# Altium project PIFWRobot.PrjPcb
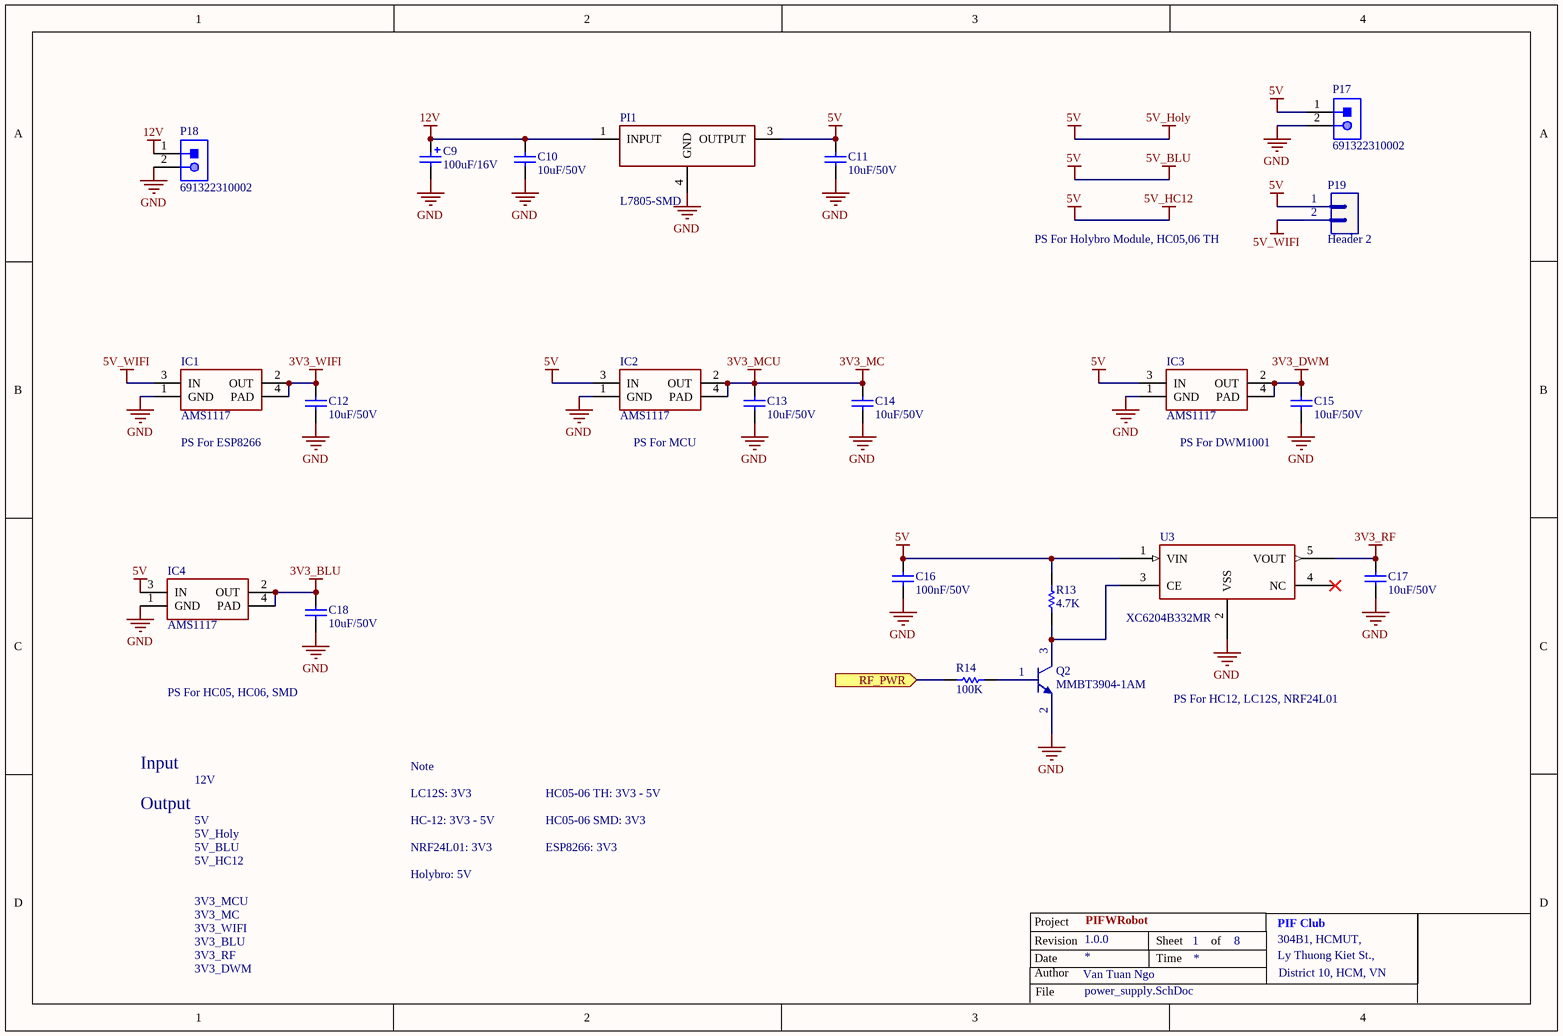
[diagram p0: power_supply.SchDoc]
5 sheets, 99 parts. Net scope: flat (ports and power ports of the same name join across sheets).
Board file: PIFWRobot.PcbDoc
Sheets:
  power_supply.SchDoc
  motor_controller.SchDoc
  bluetooth.SchDoc
  radio_frequency.SchDoc
  decawave.SchDoc

## Sheet power_supply.SchDoc
size A4; DrawnBy: Van Tuan Ngo; Organization: PIF Club; Address1: 304B1, HCMUT,; Address2: Ly Thuong Kiet St.,; Address3: District 10, HCM, VN; DocumentNumber: 1; Revision: 1.0.0; SheetNumber: 1; SheetTotal: 8; Project: PIFWRobot

### Parts
C9  value 100uF/16V  [CAP-SM-AL-SIZE-D-D6L6]  (hidden comment: Cap-Al-100uF-16V-D6L5)
C10  value 10uF/50V  [CAP-SM-0805]  (hidden comment: Cap-10uF-50V-0805)
C11  value 10uF/50V  [CAP-SM-0805]  (hidden comment: Cap-10uF-50V-0805)
C12  value 10uF/50V  [CAP-SM-0805]  (hidden comment: Cap-10uF-50V-0805)
C13  value 10uF/50V  [CAP-SM-0805]  (hidden comment: Cap-10uF-50V-0805)
C14  value 10uF/50V  [CAP-SM-0805]  (hidden comment: Cap-10uF-50V-0805)
C15  value 10uF/50V  [CAP-SM-0805]  (hidden comment: Cap-10uF-50V-0805)
C16  value 100nF/50V  [CAP-SM-0805]  (hidden comment: Cap-100nF-50V-0805)
C17  value 10uF/50V  [CAP-SM-0805]  (hidden comment: Cap-10uF-50V-0805)
C18  value 10uF/50V  [CAP-SM-0805]  (hidden comment: Cap-10uF-50V-0805)
IC1  AMS1117  [SOT223]
IC2  AMS1117  [SOT223]
IC3  AMS1117  [SOT223]
IC4  AMS1117  [SOT223]
P17  691322310002  [691322310002]
P18  691322310002  [691322310002]
P19  Header 2  [JP2]
PI1  L7805-SMD  [TO254P1435X464-4N]
Q2  MMBT3904-1AM  [SOT23_NEX]
R13  value 4.7K  [RES-SM-0805]  (hidden comment: Res-4.7K-0805)
R14  value 100K  [RES-SM-0805]  (hidden comment: Res-100K-0805)
U3  XC6204B332MR  [XC6204/05_SOT-00]

### Ports
RF_PWR (in)

### Nets
3V3_BLU: C18.2 IC4.2(OUT) IC4.4(PAD)
3V3_DWM: C15.2 IC3.2(OUT) IC3.4(PAD)
3V3_MC: C13.2 C14.2 IC2.2(OUT) IC2.4(PAD)  [also labelled 3V3_MCU]
3V3_RF: C17.2 U3.5(VOUT)
3V3_WIFI: C12.2 IC1.2(OUT) IC1.4(PAD)
5V: C11.2 C16.2 IC2.3(IN) IC3.3(IN) IC4.3(IN) P17.1 P19.1 PI1.3(OUTPUT) R13.2 U3.1(VIN)  [also labelled 5V_BLU, 5V_HC12, 5V_Holy]
5V_WIFI: IC1.3(IN) P19.2
12V: C9.1 C10.2 P18.1 PI1.1(INPUT)
GND: C9.2 C10.1 C11.1 C12.1 C13.1 C14.1 C15.1 C16.1 C17.1 C18.1 IC1.1(GND) IC2.1(GND) IC3.1(GND) IC4.1(GND) P17.2 P18.2 PI1.4(GND) Q2.2(E) U3.2(VSS)
NetQ2_1: Q2.1(B) R14.2
NetQ2_3: Q2.3(C) R13.1 U3.3(CE)
NetR14_1: R14.1 ; port RF_PWR

Not connected (* = marked no-connect by the designer): U3 4(NC)*

### Notes on the sheet
- PS For Holybro Module, HC05,06 TH
- PS For ESP8266
- (near IC2) PS For MCU
- PS For DWM1001
- PS For HC05, HC06, SMD
- PS For HC12, LC12S, NRF24L01
- Input
- 12V
- Note
- Output
- 5V
- 5V_Holy
- 5V_BLU
- LC12S: 3V3
- HC-12: 3V3 - 5V
- NRF24L01: 3V3
- HC05-06 TH: 3V3 - 5V
- HC05-06 SMD: 3V3
- ESP8266: 3V3
- 3V3_MCU
- 5V_HC12
- 3V3_MC
- Holybro: 5V
- 3V3_WIFI
- 3V3_BLU
- 3V3_RF
- 3V3_DWM
- Project
- Revision
- Date
- Author
- Sheet
- Time
- of
- File

### Library data of the parts
C9 = Cap-Al-100uF-16V-D6L5: CAP ALUM 100UF 20% 16V SMD; Manufacturer: Nichicon; Manufacturer Part Number: UWX1C101MCL1GB; Local Supplier: thegioiic; Local Supplier Link: https://www.thegioiic.com/products/tu-nhom-smd-100uf-16v-6-3x5-4mm; Supplier 1: Digikey; Supplier 1 Part Number: 493-2105-1-ND; Supplier 1 Link: https://www.digikey.com/product-detail/en/nichicon/UWX1C101MCL1GB/493-2105-1-ND/590080
C10-C15 C17 C18 = Cap-10uF-50V-0805: CAP CER 10UF 50V X5R 0805; Manufacturer: Yageo; Manufacturer Part Number: CC0805KKX5R9BB106; Local Supplier: thegioiic; Local Supplier Link: https://www.thegioiic.com/products/tu-gom-0805-10uf-50v; Supplier 1: Digikey; Supplier 1 Link: https://www.digikey.com/product-detail/en/yageo/CC0805KKX5R9BB106/311-3499-2-ND/7164383; Supplier 1 Part Number: 311-3499-2-ND
C16 = Cap-100nF-50V-0805: CAP CER 0.1UF 50V Y5V 0805; Manufacturer: Samsung Electro-Mechanics; Manufacturer Part Number: CL21F104ZBCNNNC; Local Supplier: thegioiic; Local Supplier Link: https://thegioiic.com/products/tu-100nf-0-1uf-50v-0805; Supplier 1: Digikey; Supplier 1 Part Number: 1276-1007-1-ND; Supplier 1 Link: https://www.digikey.com/product-detail/en/samsung-electro-mechanics/CL21F104ZBCNNNC/1276-1007-1-ND/3889093
IC1-IC4 = AMS1117: Available in 1.8V, 2.5V, 2.85V, 3.3V, 5V, and  Adjustable Versions; Local Supplier: thegioiic; Local Supplier Part Number: *; Local Supplier Link: https://www.thegioiic.com/products/ams1117-3-3v
P17 P18 = 691322310002: WR-TBL Serie 322 Horizontal PCB Header, Pluggable, pitch 3.81mm, 2p; Local Suppleir Part Number: x; Compliance: RoHS; Modularity: No; Pin Number: 2; Rated Current [UL]: 10A; Working Voltage [UL]: 300VAC; ComponentLink1Description: Manufacturer; ComponentLink1URL: http://www.we-online.de; ComponentLink2URL: https://katalog.we-online.de/em/datasheet/691322310002.pdf; ComponentLink2Description: Datasheet; Mounting Technology: THT; Part Number: 691322310002; Packaging: Box; Operating Temperature: -40 to +105degC; PCB/Cable/Panel: PCB; Pitch: 3.81mm; Published Date: October 2019; Type: Horizontal; Publisher: Wurth Elektronik; Application: Pluggable; Local Supplier: thegioiic; Local Supplier Link: https://www.thegioiic.com/products/kf-3-81-2-r-terminal-block-plug-in-han-pcb-2-chan-cong-3-81mm
P19 = Header 2: Header, 2-Pin; LatestRevisionDate: 17-Jul-2002; LatestRevisionNote: Re-released for DXP Platform.; Publisher: Altium Limited
R13 = Res-4.7K-0805: RES SMD 4.7K OHM 5% 1/8W 0805; Manufacturer: Yageo; Manufacturer Part Number: RC0805JR-074K7L; Local Supplier: thegioiic; Local Supplier Link: https://thegioiic.com/products/dien-tro-4-7k-ohm-0805-5; Supplier 1: Digikey; Supplier 1 Link: https://www.digikey.com/product-detail/en/yageo/RC0805JR-074K7L/311-4.7KARCT-ND/731274; Supplier 1 Part Number: 311-4.7KARCT-ND
R14 = Res-100K-0805: RES 0 OHM JUMPER 0805; Manufacturer: Vishay Dale; Manufacturer Part Number: WSL080500000ZEA9; Local Supplier: thegioiic; Local Supplier Link: https://thegioiic.com/products/dien-tro-0-ohm-0805-5; Supplier 1: Digikey; Supplier 1 Link: https://www.digikey.com/product-detail/en/vishay-dale/WSL080500000ZEA9/541-3928-1-ND/7423223; Supplier 1 Part Number: 541-3928-1-ND
U3 = XC6204B332MR: Vendor: Torex Semiconductor; Built_By: EMA_UL_Team; SourceLibrary: Torex_2016-07-05_1; Manufacturer_Part_Number: XC6204B332MR; Copyright: Copyright (C) 2018 Accelerated Designs. All rights reserved; RefDes: RefDes; Type: DEV; Local Supplier: thegioiic; Local Supplier Part Number: *; Local Supplier Link: https://www.thegioiic.com/products/xc6204b332mr-g-ic-on-ap-3-3v-150ma
PI1 = L7805-SMD: Local Supplier: thegioiic; Local Supplier Part Number: *; Local Supplier Link: https://www.thegioiic.com/products/l7805acd2t
Q2 = MMBT3904-1AM: Local Supplier: thegioiic; Local Supplier Link: https://www.thegioiic.com/products/mmbt3904-1am; Local Supplier Part Number: *

## Sheet motor_controller.SchDoc
size A4; DrawnBy: Van Tuan Ngo; Organization: PIF Club; Address1: 304B1, HCMUT,; Address2: Ly Thuong Kiet St.,; Address3: District 10, HCM, VN; DocumentNumber: 2; Revision: 1.0.0; SheetNumber: 2; SheetTotal: 8; Project: PIFWRobot
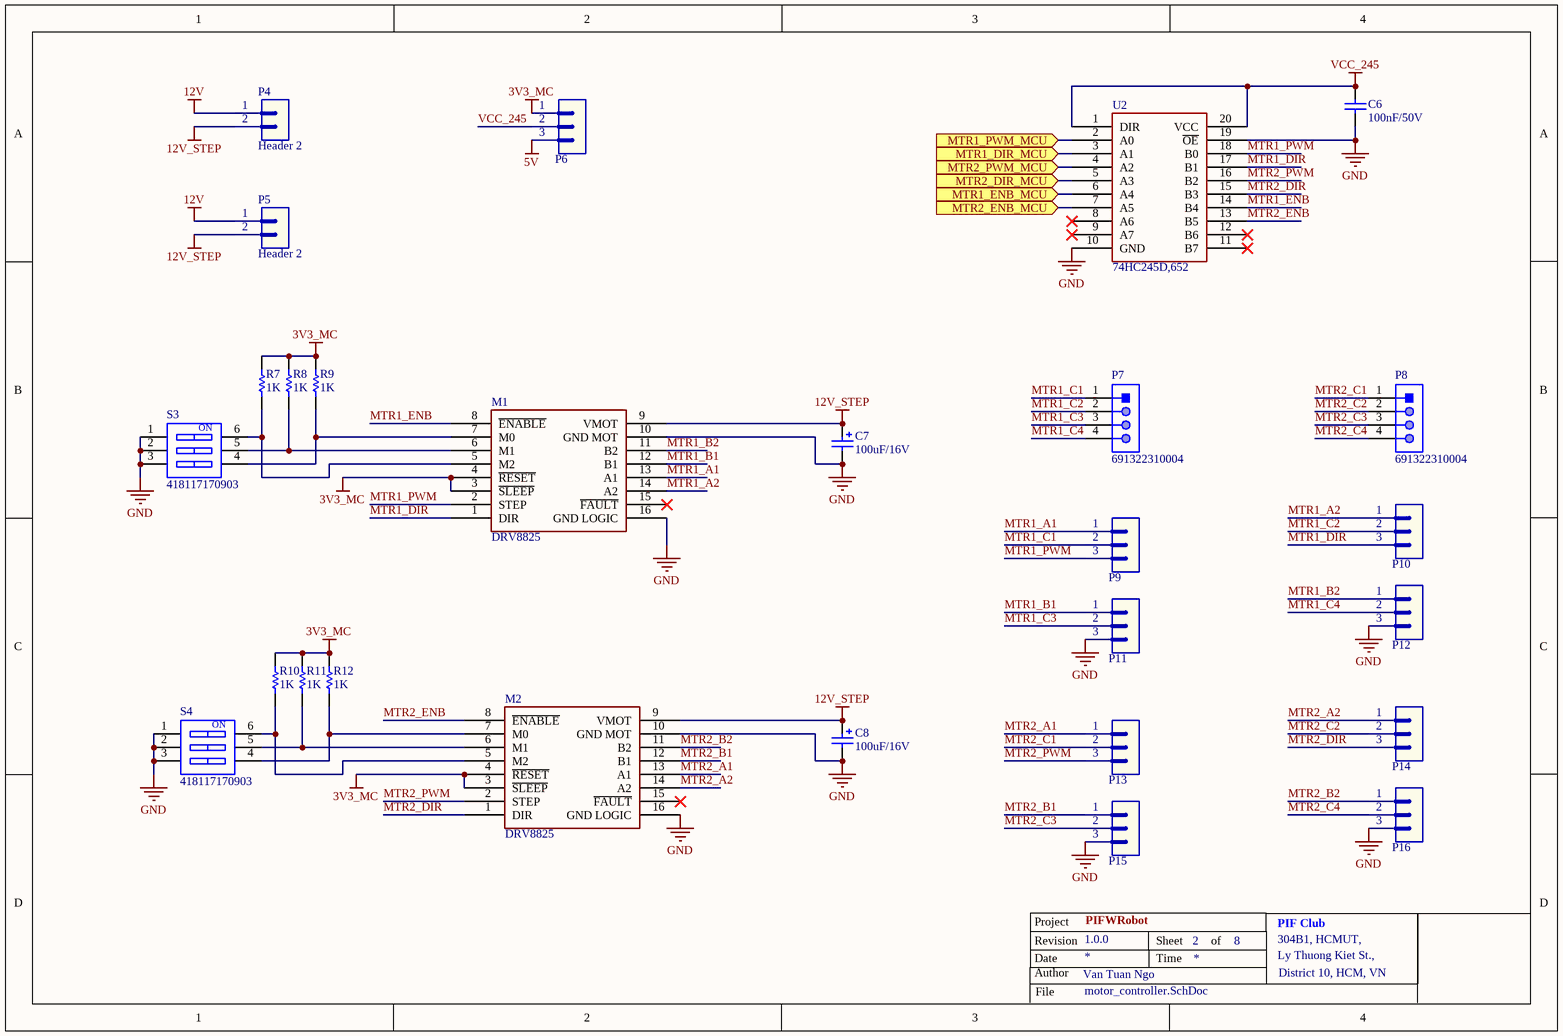
[diagram p1: motor_controller.SchDoc]

### Parts
C6  value 100nF/50V  [CAP-SM-0805]  (hidden comment: Cap-100nF-50V-0805)
C7  value 100uF/16V  [CAP-SM-AL-SIZE-D-D6L6]  (hidden comment: Cap-Al-100uF-16V-D6L5)
C8  value 100uF/16V  [CAP-SM-AL-SIZE-D-D6L6]  (hidden comment: Cap-Al-100uF-16V-D6L5)
M1  DRV8825  [DRV8825]
M2  DRV8825  [DRV8825]
P4  Header 2  [JP2]
P5  Header 2  [JP2]
P6  Header 3  [JP3]  (value not drawn)
P7  691322310004  [691322310004]
P8  691322310004  [691322310004]
P9  Header 3  [JP3]  (value not drawn)
P10  Header 3  [JP3]  (value not drawn)
P11  Header 3  [JP3]  (value not drawn)
P12  Header 3  [JP3]  (value not drawn)
P13  Header 3  [JP3]  (value not drawn)
P14  Header 3  [JP3]  (value not drawn)
P15  Header 3  [JP3]  (value not drawn)
P16  Header 3  [JP3]  (value not drawn)
R7  value 1K  [RES-SM-0805]  (hidden comment: Res-1K-0805)
R8  value 1K  [RES-SM-0805]  (hidden comment: Res-1K-0805)
R9  value 1K  [RES-SM-0805]  (hidden comment: Res-1K-0805)
R10  value 1K  [RES-SM-0805]  (hidden comment: Res-1K-0805)
R11  value 1K  [RES-SM-0805]  (hidden comment: Res-1K-0805)
R12  value 1K  [RES-SM-0805]  (hidden comment: Res-1K-0805)
S3  418117170903  [418117170903]
S4  418117170903  [418117170903]
U2  74HC245D,652  [SOT163-1_NEX]

### Ports
MTR1_DIR_MCU (in), MTR1_ENB_MCU (in), MTR1_PWM_MCU (in), MTR2_DIR_MCU (in), MTR2_ENB_MCU (in), MTR2_PWM_MCU (in)

### Nets
3V3_MC: M1.3(~{SLEEP}) M1.4(~{RESET}) M2.3(~{SLEEP}) M2.4(~{RESET}) P6.1 R7.2 R8.2 R9.2 R10.2 R11.2 R12.2
5V: P6.3
12V: P4.1 P5.1
12V_STEP: C7.1 C8.1 M1.9(VMOT) M2.9(VMOT) P4.2 P5.2
GND: C6.1 C7.2 C8.2 M1.10(GND_MOT) M1.16(GND_LOGIC) M2.10(GND_MOT) M2.16(GND_LOGIC) P11.3 P12.3 P15.3 P16.3 S3.1 S3.2 S3.3 S4.1 S4.2 S4.3 U2.10(GND) U2.19(~{OE})
VCC_245: C6.2 P6.2 U2.1(DIR) U2.20(VCC)
MTR1_A1: M1.13(A1) P9.1
MTR1_A2: M1.14(A2) P10.1
MTR1_B1: M1.12(B1) P11.1
MTR1_B2: M1.11(B2) P12.1
MTR1_C1: P7.1 P9.2
MTR1_C2: P7.2 P10.2
MTR1_C3: P7.3 P11.2
MTR1_C4: P7.4 P12.2
MTR1_DIR: M1.1(DIR) P10.3 U2.17(B1)
MTR1_ENB: M1.8(~{ENABLE}) U2.14(B4)
MTR1_PWM: M1.2(STEP) P9.3 U2.18(B0)
MTR2_A1: M2.13(A1) P13.1
MTR2_A2: M2.14(A2) P14.1
MTR2_B1: M2.12(B1) P15.1
MTR2_B2: M2.11(B2) P16.1
MTR2_C1: P8.1 P13.2
MTR2_C2: P8.2 P14.2
MTR2_C3: P8.3 P15.2
MTR2_C4: P8.4 P16.2
MTR2_DIR: M2.1(DIR) P14.3 U2.15(B3)
MTR2_ENB: M2.8(~{ENABLE}) U2.13(B5)
MTR2_PWM: M2.2(STEP) P13.3 U2.16(B2)
NetM1_5: M1.5(M2) R7.1 S3.6
NetM1_6: M1.6(M1) R8.1 S3.5
NetM1_7: M1.7(M0) R9.1 S3.4
NetM2_5: M2.5(M2) R10.1 S4.6
NetM2_6: M2.6(M1) R11.1 S4.5
NetM2_7: M2.7(M0) R12.1 S4.4
NetU2_2: U2.2(A0) ; port MTR1_PWM_MCU
NetU2_3: U2.3(A1) ; port MTR1_DIR_MCU
NetU2_4: U2.4(A2) ; port MTR2_PWM_MCU
NetU2_5: U2.5(A3) ; port MTR2_DIR_MCU
NetU2_6: U2.6(A4) ; port MTR1_ENB_MCU
NetU2_7: U2.7(A5) ; port MTR2_ENB_MCU

Not connected (* = marked no-connect by the designer): M1 15(~{FAULT})*; M2 15(~{FAULT})*; U2 8(A6)* 9(A7)* 11(B7)* 12(B6)*

### Notes on the sheet
- Project
- Revision
- Date
- Author
- Sheet
- Time
- of
- File
- (in symbol 418117170903) ON

### Library data of the parts
C6 = Cap-100nF-50V-0805: as C16 on sheet power_supply; Local Supplier: thegioiic; Local Supplier Link: https://thegioiic.com/products/tu-100nf-0-1uf-50v-0805; Supplier 1: Digikey; Supplier 1 Part Number: 1276-1007-1-ND; Supplier 1 Link: https://www.digikey.com/product-detail/en/samsung-electro-mechanics/CL21F104ZBCNNNC/1276-1007-1-ND/3889093
C7 C8 = Cap-Al-100uF-16V-D6L5: as C9 on sheet power_supply; Local Supplier: thegioiic; Local Supplier Link: https://www.thegioiic.com/products/tu-nhom-smd-100uf-16v-6-3x5-4mm; Supplier 1: Digikey; Supplier 1 Part Number: 493-2105-1-ND; Supplier 1 Link: https://www.digikey.com/product-detail/en/nichicon/UWX1C101MCL1GB/493-2105-1-ND/590080
P4 P5 = Header 2: Header, 2-Pin; LatestRevisionDate: 17-Jul-2002; LatestRevisionNote: Re-released for DXP Platform.; Publisher: Altium Limited; Local Supplier: thegioiic; Local Supplier Part Number: x; Local Supplier Link: https://www.thegioiic.com/products/hang-rao-duc-don-2-54mm-40-chan-1-hang-cao-11-4mm-xuyen-lo
P6 P9-P16 = Header 3: Header, 3-Pin; LatestRevisionDate: 17-Jul-2002; LatestRevisionNote: Re-released for DXP Platform.; Publisher: Altium Limited; Local Supplier: thegioiic; Local Supplier Part Number: x; Local Supplier Link: https://www.thegioiic.com/products/hang-rao-duc-don-2-54mm-40-chan-1-hang-cao-11-4mm-xuyen-lo
P7 P8 = 691322310004: WR-TBL Serie 322 Horizontal PCB Header, Pluggable, pitch 3.81mm, 4p; Local Suplier Part Number: x; Compliance: RoHS; Modularity: No; Pin Number: 4; Rated Current [UL]: 10A; Working Voltage [UL]: 300VAC; ComponentLink1Description: Manufacturer; ComponentLink1URL: http://www.we-online.de; ComponentLink2URL: https://katalog.we-online.de/em/datasheet/691322310004.pdf; ComponentLink2Description: Datasheet; Mounting Technology: THT; Part Number: 691322310004; Packaging: Box; Operating Temperature: -40 to +105degC; PCB/Cable/Panel: PCB; Pitch: 3.81mm; Published Date: October 2019; Type: Horizontal; Publisher: Wurth Elektronik; Application: Pluggable; Local Supplier: thegioiic; Local Supplier Link: https://www.thegioiic.com/products/ul-3-81-4-r-terminal-block-plug-in-han-pcb-4-chan-cong-3-81mm-ulo
R7-R12 = Res-1K-0805: RES 1K OHM 1% 1/4W 0805; Manufacturer: Stackpole Electronics Inc; Manufacturer Part Number: RNCP0805FTD1K00; Local Supplier: thegioiic; Local Supplier Link: https://www.thegioiic.com/products/dien-tro-1-kohm-0805-5; Supplier 1: Digikey; Supplier 1 Link: https://www.digikey.com/product-detail/en/stackpole-electronics-inc/RNCP0805FTD1K00/RNCP0805FTD1K00CT-ND/2240568; Supplier 1 Part Number: RNCP0805FTD1K00CT-ND
S3 S4 = 418117170903: WS-DITV Compact THT Dip Switch, Flat Actuator, pitch 2.54mm, 3p; Operation Force: 800g; Pole Number: 3; Actuator Type: Flat Type; Circuit: SPST-NO; Rated Current Switching: 25mA; Rated Current Non-Switching: 100mA; Rated Voltage Non-Switching: 50VDC; Rated Voltage Switching: 24VDC; ComponentLink1Description: Manufacturer; ComponentLink1URL: http://www.we-online.de; ComponentLink2Description: Datasheet; ComponentLink2URL: https://katalog.we-online.com/em/datasheet/418117170903.pdf; Pitch: 2.54mm; Contact Material: Copper Alloy; Mounting Technology: THT; Operating Temperature: -40 to +85degC; Contact Plating: Gold; Packaging: Tube; Part Number: 418117170903; Publisher: Wurth Elektronik; Published Date: September 2019; Local Supplier: thegioiic; Local Supplier Part Number: x; Local Supplier Link: https://www.thegioiic.com/products/cong-tac-3-bit-dip-switch-xuyen-lo-2-54mm-mau-do
U2 = 74HC245D,652: Vendor: Nexperia; SourceLibrary: Nexperia_2018-05-2018; Manufacturer_Part_Number: 74HC245D,652; Copyright: Copyright (C) 2016 Accelerated Designs. All rights reserved; RefDes: RefDes; Type: DEV; Local Supplier: thegioiic; Local Supplier Part number: *; Local Supplier Link: https://www.thegioiic.com/products/74hc245d
M1 M2 = DRV8825: Local Supplier: thegioiic; Local Supplier Link: https://www.thegioiic.com/products/stepstick-drv8825-mach-dieu-khien-dong-co-buoc; Local Supplier Part Number: *

## Sheet bluetooth.SchDoc
size A4; DrawnBy: Van Tuan Ngo; Organization: PIF Club; Address1: 304B1, HCMUT,; Address2: Ly Thuong Kiet St.,; Address3: District 10, HCM, VN; DocumentNumber: 5; Revision: 1.0.0; SheetNumber: 5; SheetTotal: 8; Project: PIFWRobot
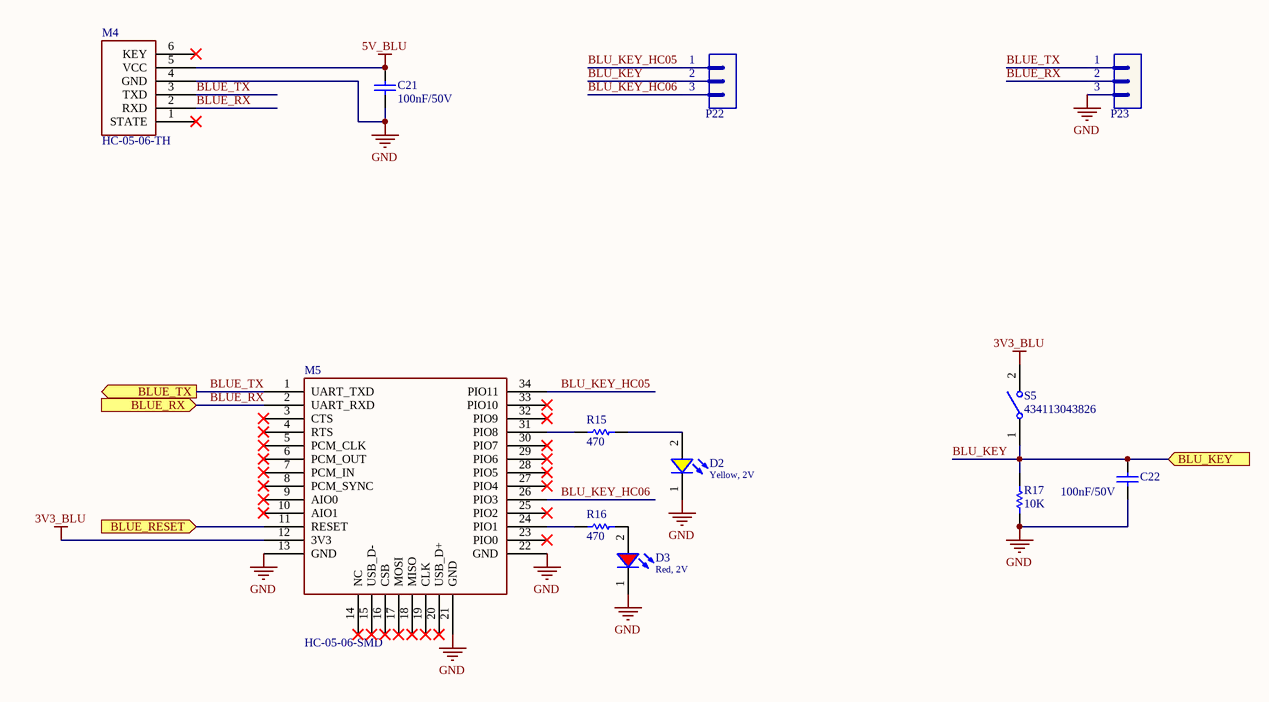
[diagram p2: bluetooth.SchDoc]

### Parts
C21  value 100nF/50V  [CAP-SM-0805]  (hidden comment: Cap-100nF-50V-0805)
C22  value 100nF/50V  [CAP-SM-0805]  (hidden comment: Cap-100nF-50V-0805)
D2  Yellow, 2V  [WL-SMCW_0805]
D3  Red, 2V  [WL-SMCW_0805]
M4  HC-05-06-TH  [HC-05-06-TH]
M5  HC-05-06-SMD  [HC-05-06-SMD]
P22  Header 3  [JP3]  (value not drawn)
P23  Header 3  [JP3]  (value not drawn)
R15  value 470  [RES-SM-0805]  (hidden comment: Res-470-0805)
R16  value 470  [RES-SM-0805]  (hidden comment: Res-470-0805)
R17  value 10K  [RES-SM-0805]  (hidden comment: Res-10k-0805)
S5  434113043826  [434113043826]

### Ports
BLU_KEY (in), BLUE_RESET (in), BLUE_RX (in), BLUE_TX (out)

### Nets
3V3_BLU: M5.12(3V3) S5.2
5V_BLU: C21.2 M4.5(VCC)  [project net 5V]
GND: C21.1 C22.1 D2.1(K) D3.1(K) M4.4(GND) M5.13(GND) M5.21(GND) M5.22(GND) P23.3 R17.2
BLU_KEY: C22.2 P22.2 R17.1 S5.1 ; port BLU_KEY
BLU_KEY_HC05: M5.34(PIO11) P22.1
BLU_KEY_HC06: M5.26(PIO3) P22.3
BLUE_RX: M4.2(RXD) M5.2(UART_RXD) P23.2 ; port BLUE_RX
BLUE_TX: M4.3(TXD) M5.1(UART_TXD) P23.1 ; port BLUE_TX
NetD2_2: D2.2(A) R15.2
NetD3_2: D3.2(A) R16.2
NetM5_11: M5.11(RESET) ; port BLUE_RESET
NetM5_24: M5.24(PIO1) R16.1
NetM5_31: M5.31(PIO8) R15.1

Not connected (* = marked no-connect by the designer): M4 1(STATE)* 6(KEY)*; M5 3(CTS)* 4(RTS)* 5(PCM_CLK)* 6(PCM_OUT)* 7(PCM_IN)* 8(PCM_SYNC)* 9(AIO0)* 10(AIO1)* 14(NC)* 15(USB_D-)* 16(CSB)* 17(MOSI)* 18(MISO)* 19(CLK)* 20(USB_D+)* 23(PIO0)* 25(PIO2)* 27(PIO4)* 28(PIO5)* 29(PIO6)* 30(PIO7)* 32(PIO9)* 33(PIO10)*

### Notes on the sheet
- Project
- Revision
- Date
- Author
- Sheet
- Time
- of
- File

### Library data of the parts
C21 C22 = Cap-100nF-50V-0805: as C16 on sheet power_supply; Local Supplier: thegioiic; Local Supplier Link: https://thegioiic.com/products/tu-100nf-0-1uf-50v-0805; Supplier 1: Digikey; Supplier 1 Part Number: 1276-1007-1-ND; Supplier 1 Link: https://www.digikey.com/product-detail/en/samsung-electro-mechanics/CL21F104ZBCNNNC/1276-1007-1-ND/3889093
D2 = 0805-Yellow: WL-SMCW SMT Mono-color Chip LED Waterclear, size 0805, Yellow, 2V, 140deg; Part Number: 150080YS75000; Chip Technology: AlInGaP; Dominant Wavelength typ.: 590nm; Luminous Intensity typ.: 120mcd; Peak Wavelength typ.: 595nm; Viewing Angle: 140deg; ComponentLink1Description: Manufacturer; ComponentLink1URL: http://www.we-online.de; ComponentLink2URL: https://www.we-online.com/catalog/datasheet/150080YS75000.pdf; ComponentLink2Description: Datasheet; Forward Voltage typ.: 2V; Emitting Color: Yellow; Mounting Technology: SMT; Operating Temperature: -40 to +85degC; Published Date: December 2019; Packaging: Tape and Reel; Size: 0805; Publisher: Wurth Elektronik; Local Supplier: thegioiic; Local Supplier Part Number: x; Local Supplier Link: https://www.thegioiic.com/products/led-vang-0805-dan-smd-trong-suot-harvatek
D3 = 0805-Red: WL-SMCW SMT Mono-color Chip LED Waterclear, size 0805, Red, 2V, 140deg; Part Number: 150080RS75000; Chip Technology: AlInGaP; Dominant Wavelength typ.: 625nm; Luminous Intensity typ.: 150mcd; Peak Wavelength typ.: 630nm; Viewing Angle: 140deg; ComponentLink1Description: Manufacturer; ComponentLink1URL: http://www.we-online.de; ComponentLink2URL: https://www.we-online.com/catalog/datasheet/150080RS75000.pdf; ComponentLink2Description: Datasheet; Forward Voltage typ.: 2V; Emitting Color: Red; Mounting Technology: SMT; Operating Temperature: -40 to +85degC; Published Date: December 2019; Packaging: Tape and Reel; Size: 0805; Publisher: Wurth Elektronik; Local Supplier: thegioiic; Local Supplier Partnumber: x; Local Supplier Link: https://www.thegioiic.com/products/led-do-0805-dan-smd-trong-suot-harvatek
P22 P23 = Header 3: Header, 3-Pin; LatestRevisionDate: 17-Jul-2002; LatestRevisionNote: Re-released for DXP Platform.; Publisher: Altium Limited; Local Supplier: thegioiic; Local Supplier Part Number: x; Local Supplier Link: https://www.thegioiic.com/products/hang-rao-duc-don-2-54mm-40-chan-1-hang-cao-11-4mm-xuyen-lo
R15 R16 = Res-470-0805: RES 470 OHM JUMPER 0805; Manufacturer: YAG6006CT-ND; Manufacturer Part Number: PE0805FRF7W0R047L; Local Supplier: thegioiic; Local Supplier Link: https://www.thegioiic.com/products/dien-tro-470-ohm-0805-5; Supplier 1: Digikey; Supplier 1 Link: https://www.digikey.com/product-detail/en/yageo/PE0805FRF7W0R047L/YAG6006CT-ND/9696460; Supplier 1 Part Number: YAG6006CT-ND
R17 = Res-10k-0805: RES 10K OHM 1% 1/4W 0805; Manufacturer: Stackpole Electronics Inc; Manufacturer Part Number: RNCP0805FTD10K0; Local Supplier: thegioiic; Local Supplier Link: https://www.thegioiic.com/products/dien-tro-10-kohm-0805-5; Supplier 1: Digikey; Supplier 1 Link: https://www.digikey.com/product-detail/en/stackpole-electronics-inc/RNCP0805FTD10K0/RNCP0805FTD10K0CT-ND/2240601; Supplier 1 Part Number: RNCP0805FTD10K0CT-ND
S5 = 434113043826: WS-TASV J-Bend SMT Tact Switch 6x3.5mm, height 4.3mm, 260gf; Rated Voltage: 12VDC; Rated Current: 50mA; Washable: No; ComponentLink1Description: Manufacturer; ComponentLink1URL: http://www.we-online.de; ComponentLink2Description: Datasheet; ComponentLink2URL: https://katalog.we-online.com/em/datasheet/434113043826.pdf; Operating Temperature: -40 to +85degC; Part Number: 434113043826; Published Date: September 2019; Contact Material: Stainless Steel; Height: 4.3mm; Mounting Technology: SMT; Contact Plating: Silver; Operation Force: 260gf; Packaging: Tape and Reel; Terminal Material: Copper Alloy; Publisher: Wurth Elektronik; Terminal Plating: Silver; Local Supplier: thegioiic; Local Supplier Link: https://www.thegioiic.com/products/nut-nhan-3-5x6mm-cao-5mm-2-chan-smd-dau-trang; Local Supplier Part Number: x
M4 = HC-05-06-TH: Manufacturer: *; Manufacturer Part Number: *; Local Supplier: thegioiic; Local Supplier Part Numer: *; Local Supplier Link: https://www.thegioiic.com/products/hc-05-thu-phat-bluetooth-ra-chan-master-slave
M5 = HC-05-06-SMD: Manufacturer: *; Manufacturer Part Number: *; Local Supplier: thegioiic; Local Supplier Part Numer: *; Local Supplier Link: https://www.thegioiic.com/products/hc-05-thu-phat-bluetooth-chua-ra-chan-master-slave

## Sheet radio_frequency.SchDoc
size A4; DrawnBy: Van Tuan Ngo; Organization: PIF Club; Address1: 304B1, HCMUT,; Address2: Ly Thuong Kiet St.,; Address3: District 10, HCM, VN; DocumentNumber: 7; Revision: 1.0.0; SheetNumber: 7; SheetTotal: 8; Project: PIFWRobot
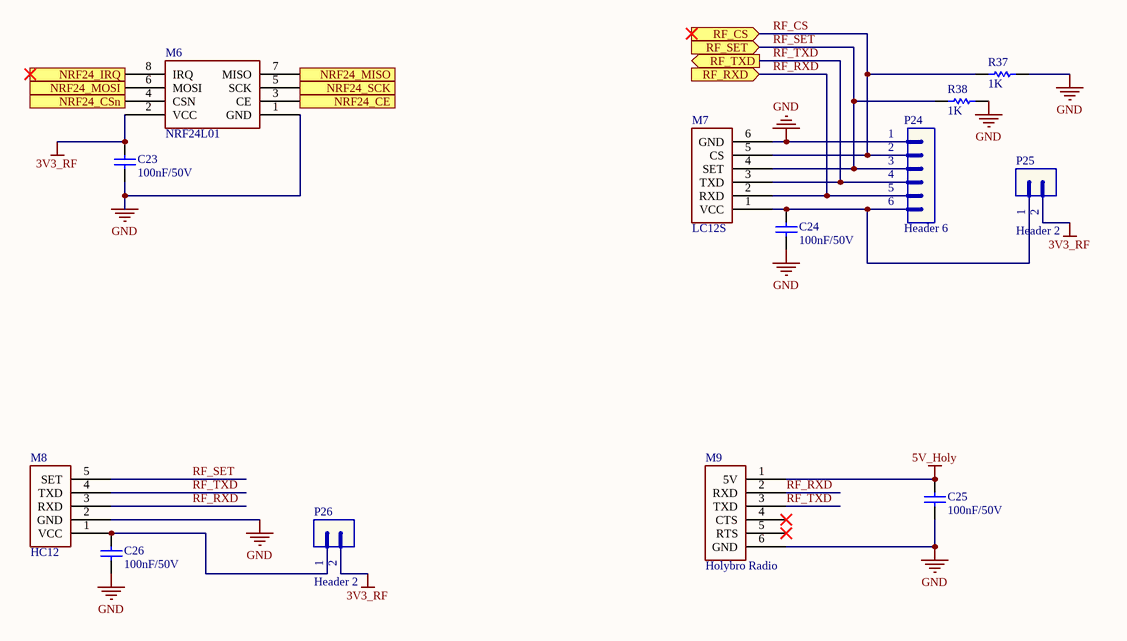
[diagram p3: radio_frequency.SchDoc]

### Parts
C23  value 100nF/50V  [CAP-SM-0805]  (hidden comment: Cap-100nF-50V-0805)
C24  value 100nF/50V  [CAP-SM-0805]  (hidden comment: Cap-100nF-50V-0805)
C25  value 100nF/50V  [CAP-SM-0805]  (hidden comment: Cap-100nF-50V-0805)
C26  value 100nF/50V  [CAP-SM-0805]  (hidden comment: Cap-100nF-50V-0805)
M6  NRF24L01  [NRF24L01]
M7  LC12S  [LC12S]
M8  HC12  [HC12]
M9  Holybro Radio  [HOLYBRO-RADIO]
P24  Header 6  [JP6]
P25  Header 2  [JP2]
P26  Header 2  [JP2]
R37  value 1K  [RES-SM-0805]  (hidden comment: Res-1K-0805)
R38  value 1K  [RES-SM-0805]  (hidden comment: Res-1K-0805)

### Ports
NRF24_CE (in), NRF24_CSn (in), NRF24_IRQ (out), NRF24_MISO (out), NRF24_MOSI (in), NRF24_SCK (in), RF_CS (in), RF_RXD (in), RF_SET (in), RF_TXD (out)

### Nets
3V3_RF: C23.2 M6.2(VCC) P25.2 P26.2
5V_Holy: C25.2 M9.1(5V)  [project net 5V]
GND: C23.1 C24.1 C25.1 C26.1 M6.1(GND) M7.6(GND) M8.2(GND) M9.6(GND) P24.1 R37.2 R38.2
RF_CS: M7.5(CS) P24.2 R37.1 ; port RF_CS
RF_RXD: M7.2(RXD) M8.3(RXD) M9.2(RXD) P24.5 ; port RF_RXD
RF_SET: M7.4(SET) M8.5(SET) P24.3 R38.1 ; port RF_SET
RF_TXD: M7.3(TXD) M8.4(TXD) M9.3(TXD) P24.4 ; port RF_TXD
NetC24_2: C24.2 M7.1(VCC) P24.6 P25.1
NetC26_2: C26.2 M8.1(VCC) P26.1
NetM6_3: M6.3(CE) ; port NRF24_CE
NetM6_4: M6.4(CSN) ; port NRF24_CSn
NetM6_5: M6.5(SCK) ; port NRF24_SCK
NetM6_6: M6.6(MOSI) ; port NRF24_MOSI
NetM6_7: M6.7(MISO) ; port NRF24_MISO
NetM6_8: M6.8(IRQ) ; port NRF24_IRQ

Not connected (* = marked no-connect by the designer): M9 4(CTS)* 5(RTS)*

### Notes on the sheet
- Project
- Revision
- Date
- Author
- Sheet
- Time
- of
- File

### Library data of the parts
C23-C26 = Cap-100nF-50V-0805: as C16 on sheet power_supply; Local Supplier: thegioiic; Local Supplier Link: https://thegioiic.com/products/tu-100nf-0-1uf-50v-0805; Supplier 1: Digikey; Supplier 1 Part Number: 1276-1007-1-ND; Supplier 1 Link: https://www.digikey.com/product-detail/en/samsung-electro-mechanics/CL21F104ZBCNNNC/1276-1007-1-ND/3889093
P24 = Header 6: Header, 6-Pin; LatestRevisionDate: 17-Jul-2002; LatestRevisionNote: Re-released for DXP Platform.; Publisher: Altium Limited; Local Supplier Link: https://www.thegioiic.com/products/hang-rao-duc-don-2-54mm-40-chan-1-hang-cao-11-4mm-xuyen-lo; Local Supplier: thegioiic; Local Supplier Part Number: x
P25 P26 = Header 2: Header, 2-Pin; LatestRevisionDate: 17-Jul-2002; LatestRevisionNote: Re-released for DXP Platform.; Publisher: Altium Limited; Local Supplier: thegioiic; Local Supplier Part Number: x; Local Supplier Link: https://www.thegioiic.com/products/hang-rao-duc-don-2-54mm-40-chan-1-hang-cao-11-4mm-xuyen-lo
R37 R38 = Res-1K-0805: as R7 on sheet motor_controller; Local Supplier: thegioiic; Local Supplier Link: https://www.thegioiic.com/products/dien-tro-1-kohm-0805-5; Supplier 1: Digikey; Supplier 1 Link: https://www.digikey.com/product-detail/en/stackpole-electronics-inc/RNCP0805FTD1K00/RNCP0805FTD1K00CT-ND/2240568; Supplier 1 Part Number: RNCP0805FTD1K00CT-ND
M6 = NRF24L01: Local Supplier: thegioiic; Local Supplier Part Number: *; Manufacturer: *; Manufactuere Part Number: *; Local Supplier Link: https://www.thegioiic.com/products/nrf24l01-pa-lna-thu-phat-rf-2-4ghz-1000m
M7 = LC12S: Manufacturer: *; Manufacturer Part Number: *; Local Supplier: thegioiic; Local Supplier Link: https://www.thegioiic.com/products/lc12s-mach-thu-phat-rf-2-4ghz-uart-128-kenh-120m; Local Supplier Part Number: *
M8 = HC12: Manufacturer: *; Manufacturer Part Number: *; Local Supplier: thegioiic; Local Supplier Link: https://www.thegioiic.com/products/hc-12-si4463-mach-thu-phat-rf-433mhz-1000m; Local Supplier Part Number: *
M9 = Holybro Radio: Supplier: *; Supplier Part Number: *; Manufacturer: *; Manufacturer Part Number: *; Supplier Link: https://www.lazada.vn/products/ld-holybro-433mhz-915-mhz-500-mw-thu-phat-vo-tuyen-xa-bo-v3-cho-pixhawk-4-dieu-khien-chuyen-bay-i430804435-s768474304.html?spm=a2o4n.searchlist.list.4.25396b19yIS9XO&search=1; Local Supplier: x; Local Supplier Part Number: x; Local Supplier Link: x

## Sheet decawave.SchDoc
size A4; DrawnBy: Van Tuan Ngo; Organization: PIF Club; Address1: 304B1, HCMUT,; Address2: Ly Thuong Kiet St.,; Address3: District 10, HCM, VN; DocumentNumber: 8; Revision: 1.0.0; SheetNumber: 8; SheetTotal: 8; Project: PIFWRobot
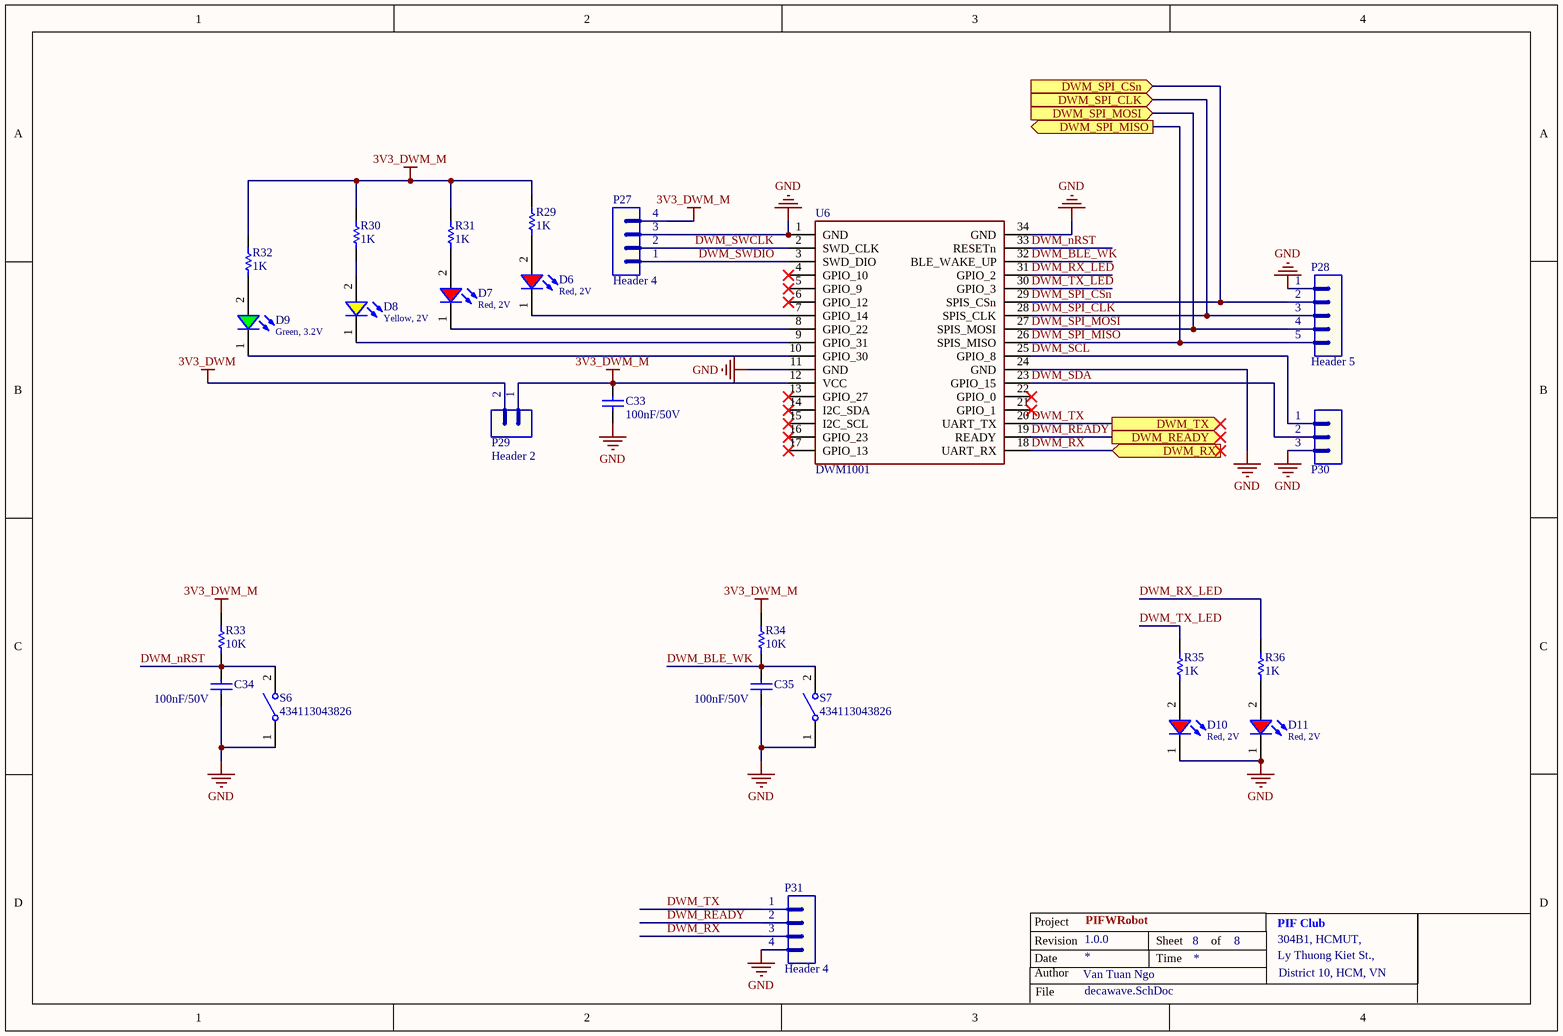
[diagram p4: decawave.SchDoc]

### Parts
C33  value 100nF/50V  [CAP-SM-0805]  (hidden comment: Cap-100nF-50V-0805)
C34  value 100nF/50V  [CAP-SM-0805]  (hidden comment: Cap-100nF-50V-0805)
C35  value 100nF/50V  [CAP-SM-0805]  (hidden comment: Cap-100nF-50V-0805)
D6  Red, 2V  [WL-SMCW_0805]
D7  Red, 2V  [WL-SMCW_0805]
D8  Yellow, 2V  [WL-SMCW_0805]
D9  Green, 3.2V  [WL-SMCW_0805]
D10  Red, 2V  [WL-SMCW_0805]
D11  Red, 2V  [WL-SMCW_0805]
P27  Header 4  [JP4]
P28  Header 5  [JP5]
P29  Header 2  [JP2]
P30  Header 3  [JP3]  (value not drawn)
P31  Header 4  [JP4]
R29  value 1K  [RES-SM-0805]  (hidden comment: Res-1K-0805)
R30  value 1K  [RES-SM-0805]  (hidden comment: Res-1K-0805)
R31  value 1K  [RES-SM-0805]  (hidden comment: Res-1K-0805)
R32  value 1K  [RES-SM-0805]  (hidden comment: Res-1K-0805)
R33  value 10K  [RES-SM-0805]  (hidden comment: Res-10k-0805)
R34  value 10K  [RES-SM-0805]  (hidden comment: Res-10k-0805)
R35  value 1K  [RES-SM-0805]  (hidden comment: Res-1K-0805)
R36  value 1K  [RES-SM-0805]  (hidden comment: Res-1K-0805)
S6  434113043826  [434113043826]
S7  434113043826  [434113043826]
U6  DWM1001  [DWM1001]

### Ports
DWM_READY (out), DWM_RX (in), DWM_SPI_CLK (in), DWM_SPI_CSn (in), DWM_SPI_MISO (out), DWM_SPI_MOSI (in), DWM_TX (out)

### Nets
3V3_DWM: P29.2
3V3_DWM_M: C33.2 P27.4 P29.1 R29.2 R30.2 R31.2 R32.2 R33.2 R34.2 U6.12(VCC)
GND: C33.1 C34.1 C35.1 D10.1(K) D11.1(K) P27.3 P28.1 P30.3 P31.4 S6.1 S7.1 U6.1(GND) U6.11(GND) U6.24(GND) U6.34(GND)
DWM_BLE_WK: C35.2 R34.1 S7.2 U6.32(BLE_WAKE_UP)
DWM_nRST: C34.2 R33.1 S6.2 U6.33(RESETn)
DWM_READY: P31.2 U6.19(READY) ; port DWM_READY
DWM_RX: P31.3 U6.18(UART_RX) ; port DWM_RX
DWM_RX_LED: R36.2 U6.31(GPIO_2)
DWM_SCL: P30.1 U6.25(GPIO_8)
DWM_SDA: P30.2 U6.23(GPIO_15)
DWM_SPI_CLK: P28.3 U6.28(SPIS_CLK) ; port DWM_SPI_CLK
DWM_SPI_CSn: P28.2 U6.29(SPIS_CSn) ; port DWM_SPI_CSn
DWM_SPI_MISO: P28.5 U6.26(SPIS_MISO) ; port DWM_SPI_MISO
DWM_SPI_MOSI: P28.4 U6.27(SPIS_MOSI) ; port DWM_SPI_MOSI
DWM_SWCLK: P27.2 U6.2(SWD_CLK)
DWM_SWDIO: P27.1 U6.3(SWD_DIO)
DWM_TX: P31.1 U6.20(UART_TX) ; port DWM_TX
DWM_TX_LED: R35.2 U6.30(GPIO_3)
NetD6_1: D6.1(K) U6.7(GPIO_14)
NetD6_2: D6.2(A) R29.1
NetD7_1: D7.1(K) U6.8(GPIO_22)
NetD7_2: D7.2(A) R31.1
NetD8_1: D8.1(K) U6.9(GPIO_31)
NetD8_2: D8.2(A) R30.1
NetD9_1: D9.1(K) U6.10(GPIO_30)
NetD9_2: D9.2(A) R32.1
NetD10_2: D10.2(A) R35.1
NetD11_2: D11.2(A) R36.1

Not connected (* = marked no-connect by the designer): U6 4(GPIO_10)* 5(GPIO_9)* 6(GPIO_12)* 13(GPIO_27)* 14(I2C_SDA)* 15(I2C_SCL)* 16(GPIO_23)* 17(GPIO_13)* 21(GPIO_1)* 22(GPIO_0)*

### Notes on the sheet
- Project
- Revision
- Date
- Author
- Sheet
- Time
- of
- File

### Library data of the parts
C33-C35 = Cap-100nF-50V-0805: as C16 on sheet power_supply; Local Supplier: thegioiic; Local Supplier Link: https://thegioiic.com/products/tu-100nf-0-1uf-50v-0805; Supplier 1: Digikey; Supplier 1 Part Number: 1276-1007-1-ND; Supplier 1 Link: https://www.digikey.com/product-detail/en/samsung-electro-mechanics/CL21F104ZBCNNNC/1276-1007-1-ND/3889093
D6 D7 D10 D11 = 0805-Red: as D3 on sheet bluetooth; Viewing Angle: 140deg; ComponentLink1Description: Manufacturer; ComponentLink1URL: http://www.we-online.de; ComponentLink2URL: https://www.we-online.com/catalog/datasheet/150080RS75000.pdf; ComponentLink2Description: Datasheet; Forward Voltage typ.: 2V; Emitting Color: Red; Mounting Technology: SMT; Operating Temperature: -40 to +85degC; Published Date: December 2019; Packaging: Tape and Reel; Size: 0805; Publisher: Wurth Elektronik; Local Supplier: thegioiic; Local Supplier Partnumber: x; Local Supplier Link: https://www.thegioiic.com/products/led-do-0805-dan-smd-trong-suot-harvatek
D8 = 0805-Yellow: as D2 on sheet bluetooth; Viewing Angle: 140deg; ComponentLink1Description: Manufacturer; ComponentLink1URL: http://www.we-online.de; ComponentLink2URL: https://www.we-online.com/catalog/datasheet/150080YS75000.pdf; ComponentLink2Description: Datasheet; Forward Voltage typ.: 2V; Emitting Color: Yellow; Mounting Technology: SMT; Operating Temperature: -40 to +85degC; Published Date: December 2019; Packaging: Tape and Reel; Size: 0805; Publisher: Wurth Elektronik; Local Supplier: thegioiic; Local Supplier Part Number: x; Local Supplier Link: https://www.thegioiic.com/products/led-vang-0805-dan-smd-trong-suot-harvatek
D9 = 0805-Green: WL-SMCW SMT Mono-color Chip LED Waterclear, size 0805, Green, 3.2V, 140deg; Part Number: 150080GS75000; Chip Technology: InGaN; Dominant Wavelength typ.: 525nm; Luminous Intensity typ.: 450mcd; Peak Wavelength typ.: 515nm; Viewing Angle: 140deg; ComponentLink1Description: Manufacturer; ComponentLink1URL: http://www.we-online.de; ComponentLink2URL: https://www.we-online.com/catalog/datasheet/150080GS75000.pdf; ComponentLink2Description: Datasheet; Forward Voltage typ.: 3.2V; Emitting Color: Green; Mounting Technology: SMT; Operating Temperature: -40 to +85degC; Published Date: December 2019; Packaging: Tape and Reel; Size: 0805; Publisher: Wurth Elektronik; Local Supplier: thegioiic; Local Supplier Part Number: x; Local Supplier Link: https://www.thegioiic.com/products/led-xanh-la-0805-dan-smd-trong-suot-harvatek
P27 P31 = Header 4: Header, 4-Pin; LatestRevisionDate: 17-Jul-2002; LatestRevisionNote: Re-released for DXP Platform.; Publisher: Altium Limited; Local Supplier: thegioiic; Local Supplier Part Number: x; Local Supplier Link: https://www.thegioiic.com/products/hang-rao-duc-don-2-54mm-40-chan-1-hang-cao-11-4mm-xuyen-lo
P28 = Header 5: Header, 5-Pin; LatestRevisionDate: 17-Jul-2002; LatestRevisionNote: Re-released for DXP Platform.; Publisher: Altium Limited; Local Supplier Link: https://www.thegioiic.com/products/hang-rao-duc-don-2-54mm-40-chan-1-hang-cao-11-4mm-xuyen-lo; Local Supplier: thegioiic; Local Supplier Part Number: x
P29 = Header 2: Header, 2-Pin; LatestRevisionDate: 17-Jul-2002; LatestRevisionNote: Re-released for DXP Platform.; Publisher: Altium Limited; Local Supplier: thegioiic; Local Supplier Part Number: x; Local Supplier Link: https://www.thegioiic.com/products/hang-rao-duc-don-2-54mm-40-chan-1-hang-cao-11-4mm-xuyen-lo
P30 = Header 3: Header, 3-Pin; LatestRevisionDate: 17-Jul-2002; LatestRevisionNote: Re-released for DXP Platform.; Publisher: Altium Limited; Local Supplier: thegioiic; Local Supplier Part Number: x; Local Supplier Link: https://www.thegioiic.com/products/hang-rao-duc-don-2-54mm-40-chan-1-hang-cao-11-4mm-xuyen-lo
R29-R32 R35 R36 = Res-1K-0805: as R7 on sheet motor_controller; Local Supplier: thegioiic; Local Supplier Link: https://www.thegioiic.com/products/dien-tro-1-kohm-0805-5; Supplier 1: Digikey; Supplier 1 Link: https://www.digikey.com/product-detail/en/stackpole-electronics-inc/RNCP0805FTD1K00/RNCP0805FTD1K00CT-ND/2240568; Supplier 1 Part Number: RNCP0805FTD1K00CT-ND
R33 R34 = Res-10k-0805: as R17 on sheet bluetooth; Local Supplier: thegioiic; Local Supplier Link: https://www.thegioiic.com/products/dien-tro-10-kohm-0805-5; Supplier 1: Digikey; Supplier 1 Link: https://www.digikey.com/product-detail/en/stackpole-electronics-inc/RNCP0805FTD10K0/RNCP0805FTD10K0CT-ND/2240601; Supplier 1 Part Number: RNCP0805FTD10K0CT-ND
S6 S7 = 434113043826: as S5 on sheet bluetooth; ComponentLink1Description: Manufacturer; ComponentLink1URL: http://www.we-online.de; ComponentLink2Description: Datasheet; ComponentLink2URL: https://katalog.we-online.com/em/datasheet/434113043826.pdf; Operating Temperature: -40 to +85degC; Part Number: 434113043826; Published Date: September 2019; Contact Material: Stainless Steel; Height: 4.3mm; Mounting Technology: SMT; Contact Plating: Silver; Operation Force: 260gf; Packaging: Tape and Reel; Terminal Material: Copper Alloy; Publisher: Wurth Elektronik; Terminal Plating: Silver; Local Supplier: thegioiic; Local Supplier Link: https://www.thegioiic.com/products/nut-nhan-3-5x6mm-cao-5mm-2-chan-smd-dau-trang; Local Supplier Part Number: x
U6 = DWM1001: Local Supplier: x; Local Supplier Part Number: x; Local Supplier Link: x

## Nets that join several sheets
3V3_BLU: power_supply (C18.2 IC4.2 IC4.4), bluetooth (M5.12 S5.2)
3V3_DWM: power_supply (C15.2 IC3.2 IC3.4), decawave (P29.2)
3V3_MC: power_supply (C13.2 C14.2 IC2.2 IC2.4), motor_controller (11 pins)
3V3_RF: power_supply (C17.2 U3.5), radio_frequency (C23.2 M6.2 P25.2 P26.2)
5V: power_supply (10 pins), motor_controller (P6.3), bluetooth (C21.2 M4.5), radio_frequency (C25.2 M9.1)
12V: power_supply (C9.1 C10.2 P18.1 PI1.1), motor_controller (P4.1 P5.1)
GND: power_supply (19 pins), motor_controller (19 pins), bluetooth (10 pins), radio_frequency (11 pins), decawave (15 pins)